# EAGLE design PocketSDR_Discovery (EAGLE 9.6.2)
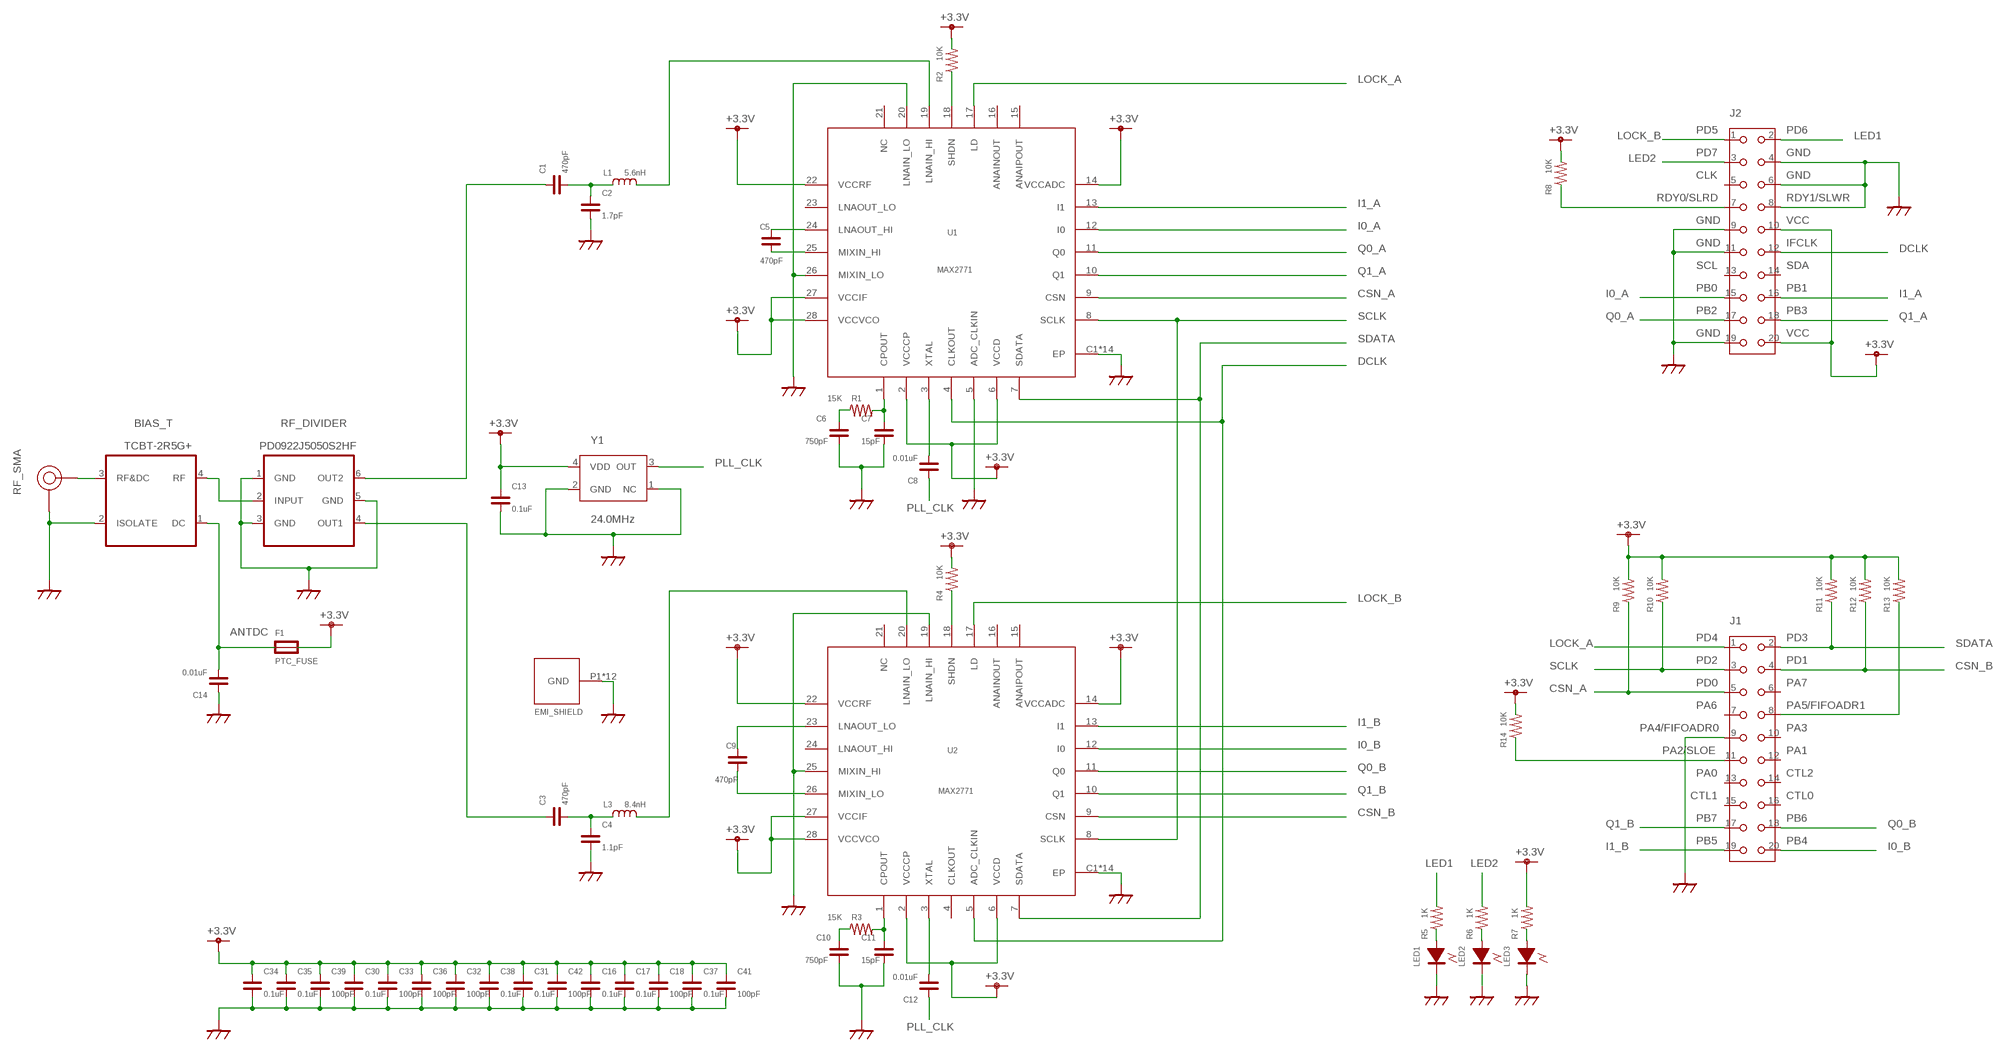
[diagram p0: schematic, sheet 1]

## Parts
BIAS_T  TCBT-2R5G+  BIAS_T  [BIAS_T]
C1  470pF  C1005  [C1005]
C2  1.7pF  C1005  [C1005]
C3  470pF  C1005  [C1005]
C4  1.1pF  C1005  [C1005]
C5  470pF  C1005  [C1005]
C6  750pF  C1005  [C1005]
C7  15pF  C1005  [C1005]
C8  0.01uF  C1005  [C1005]
C9  470pF  C1005  [C1005]
C10  750pF  C1005  [C1005]
C11  15pF  C1005  [C1005]
C12  0.01uF  C1005  [C1005]
C13  0.1uF  C1005  [C1005]
C14  0.01uF  C1005  [C1005]
C16  0.1uF  C1005  [C1005]
C17  0.1uF  C1005  [C1005]
C18  100pF  C1005  [C1005]
C30  0.1uF  C1005  [C1005]
C31  0.1uF  C1005  [C1005]
C32  100pF  C1005  [C1005]
C33  100pF  C1005  [C1005]
C34  0.1uF  C1005  [C1005]
C35  0.1uF  C1005  [C1005]
C36  100pF  C1005  [C1005]
C37  0.1uF  C1005  [C1005]
C38  0.1uF  C1005  [C1005]
C39  100pF  C1005  [C1005]
C41  100pF  C1005  [C1005]
C42  100pF  C1005  [C1005]
F1  PTC_FUSE  [C1608]
J1  PINH-2.54MM-20P  [PINH-2.54MM-20P]
J2  PINH-2.54MM-20P  [PINH-2.54MM-20P]
L1  5.6nH  L1608  [C1608]
L3  8.4nH  L1608  [C1608]
LED1  LED1608  [LED_1608]
LED2  LED1608  [LED_1608]
LED3  LED1608  [LED_1608]
R1  15K  R1005  [C1005]
R2  10K  R1005  [C1005]
R3  15K  R1005  [C1005]
R4  10K  R1005  [C1005]
R5  1K  R1005  [C1005]
R6  1K  R1005  [C1005]
R7  1K  R1005  [C1005]
R8  10K  R1005  [C1005]
R9  10K  R1005  [C1005]
R10  10K  R1005  [C1005]
R11  10K  R1005  [C1005]
R12  10K  R1005  [C1005]
R13  10K  R1005  [C1005]
R14  10K  R1005  [C1005]
RF-SHEILD-CASE  BMI-S-202-F BMI-S-202-C  BMI-S-202  [BMI-S-202]
RF_DIVIDER  PD0922J5050S2HF  RF_DIV  [RF_DIV]
RF_SMA  SMA JACK EDGE MNT  SMA-ANG  [SMA-ANG]
U1  MAX2771  [TQFN28]
U2  MAX2771  [TQFN28]
Y1  24.0MHz  TCXO2520  [TCXO2520]

## Nets
+3.3V: C13.1 C16.1 C17.1 C18.1 C30.1 C31.1 C32.1 C33.1 C34.1 C35.1 C36.1 C37.1 C38.1 C39.1 C41.1 C42.1 F1.2 J2.10 J2.20 R2.2 R4.2 R7.2 R8.2 R9.2 R10.2 R11.2 R12.2 R13.2 R14.2 U1.2(VCCCP) U1.6(VCCD) U1.14(VCCADC) U1.22(VCCRF) U1.27(VCCIF) U1.28(VCCVCO) U2.2(VCCCP) U2.6(VCCD) U2.14(VCCADC) U2.22(VCCRF) U2.27(VCCIF) U2.28(VCCVCO) Y1.4(VDD)
ANTDC: BIAS_T.1(DC) C14.2 F1.1
CSN_A: J1.5 R9.1 U1.9(CSN)
CSN_B: J1.4 R12.1 U2.9(CSN)
DCLK: J2.12 U1.4(CLKOUT) U2.5(ADC_CLKIN)
FIFOADR1: J1.8 R13.1
GND: BIAS_T.2(ISOLATE) C2.1 C4.2 C6.2 C7.2 C10.2 C11.2 C13.2 C14.1 C16.2 C17.2 C18.2 C30.2 C31.2 C32.2 C33.2 C34.2 C35.2 C36.2 C37.2 C38.2 C39.2 C41.2 C42.2 J1.9 J2.4 J2.6 J2.8 J2.9 J2.11 J2.19 LED1.2 LED2.2 LED3.2 RF-SHEILD-CASE.P1(GND) RF-SHEILD-CASE.P2(GND) RF-SHEILD-CASE.P3(GND) RF-SHEILD-CASE.P4(GND) RF-SHEILD-CASE.P5(GND) RF-SHEILD-CASE.P6(GND) RF-SHEILD-CASE.P7(GND) RF-SHEILD-CASE.P8(GND) RF-SHEILD-CASE.P9(GND) RF-SHEILD-CASE.P10(GND) RF-SHEILD-CASE.P11(GND) RF-SHEILD-CASE.P12(GND) RF_DIVIDER.1(GND) RF_DIVIDER.3(GND) RF_DIVIDER.5(GND) RF_SMA.P2(GND) RF_SMA.P3(GND) RF_SMA.P4(GND) RF_SMA.P5(GND) U1.5(ADC_CLKIN) U1.20(LNAIN_LO) U1.26(MIXIN_LO) U1.C1(EP) U1.C2(EP) U1.C3(EP) U1.C4(EP) U1.EP U1.V1(EP) U1.V2(EP) U1.V3(EP) U1.V4(EP) U1.V5(EP) U1.V6(EP) U1.V7(EP) U1.V8(EP) U1.V9(EP) U2.19(LNAIN_HI) U2.25(MIXIN_HI) U2.C1(EP) U2.C2(EP) U2.C3(EP) U2.C4(EP) U2.EP U2.V1(EP) U2.V2(EP) U2.V3(EP) U2.V4(EP) U2.V5(EP) U2.V6(EP) U2.V7(EP) U2.V8(EP) U2.V9(EP) Y1.1(NC) Y1.2(GND)
I0_A: J2.15 U1.12(I0)
I0_B: J1.20 U2.12(I0)
I1_A: J2.16 U1.13(I1)
I1_B: J1.19 U2.13(I1)
LED1: J2.2 R5.2
LED2: J2.3 R6.2
LOCK_A: J1.1 U1.17(LD)
LOCK_B: J2.1 U2.17(LD)
N$1: C5.2 U1.25(MIXIN_HI)
N$2: C5.1 U1.24(LNAOUT_HI)
N$3: BIAS_T.3(RF&DC) RF_SMA.P1(RF)
N$4: BIAS_T.4(RF) RF_DIVIDER.2(INPUT)
N$5: LED3.1(+) R7.1
N$6: LED2.1(+) R6.1
N$7: LED1.1(+) R5.1
N$9: C1.2 C2.2 L1.1
N$10: C8.2 U1.3(XTAL)
N$12: L1.2 U1.19(LNAIN_HI)
N$14: C1.1 RF_DIVIDER.6(OUT2)
N$15: C9.2 U2.26(MIXIN_LO)
N$16: C9.1 U2.23(LNAOUT_LO)
N$18: R2.1 U1.18(SHDN)
N$24: C7.1 R1.2 U1.1(CPOUT)
N$25: C6.1 R1.1
N$27: C11.1 R3.2 U2.1(CPOUT)
N$32: C10.1 R3.1
N$35: C3.1 RF_DIVIDER.4(OUT1)
N$37: C3.2 C4.1 L3.1
N$38: L3.2 U2.20(LNAIN_LO)
N$42: R4.1 U2.18(SHDN)
N$43: C12.2 U2.3(XTAL)
PLL_CLK: C8.1 C12.1 Y1.3(OUT)
Q0_A: J2.17 U1.11(Q0)
Q0_B: J1.18 U2.11(Q0)
Q1_A: J2.18 U1.10(Q1)
Q1_B: J1.17 U2.10(Q1)
SCLK: J1.3 R10.1 U1.8(SCLK) U2.8(SCLK)
SDATA: J1.2 R11.1 U1.7(SDATA) U2.7(SDATA)
SLOE: J1.11 R14.1
SLRD: J2.7 R8.1
Unconnected: J1.6 J1.7 J1.10 J1.12 J1.13 J1.14 J1.15 J1.16 J2.5 J2.13 J2.14 U1.15(ANAIPOUT) U1.16(ANAINOUT) U1.21(NC) U1.23(LNAOUT_LO) U2.4(CLKOUT) U2.15(ANAIPOUT) U2.16(ANAINOUT) U2.21(NC) U2.24(LNAOUT_HI)

## Notes on the sheet
- PD5 | PD6
- PD7 | GND
- CLK | GND
- RDY0/SLRD | RDY1/SLWR
- GND | VCC
- GND | IFCLK
- SCL | SDA
- PB0 | PB1
- PB2 | PB3
- GND | VCC
- PD4 | PD3
- PD2 | PD1
- PD0 | PA7
- PA6 | PA5/FIFOADR1
- PA4/FIFOADR0 | PA3
- PA2/SLOE | PA1
- PA0 | CTL2
- CTL1 | CTL0
- PB7 | PB6
- PB5 | PB4

## Library data of the parts
BIAS_T = ttaka_misc2:BIAS_T
C1-C14 C16-C18 C30-C39 C41 C42 = ttaka_desc:C1005
F1 = ttaka_desc:PTC_FUSE
J1 J2 = ttaka_conn:PINH-2.54MM-20P
L1 L3 = ublox:L1608
LED1-LED3 = ttaka_desc:LED1608
R1-R14 = ttaka_desc:R1005
RF-SHEILD-CASE = ttaka_misc:BMI-S-202
RF_DIVIDER = ttaka_misc:RF_DIV
RF_SMA = ttaka_conn:SMA-ANG
U1 U2 = ttaka_ic:MAX2771
Y1 = ttaka_misc:TCXO2520

## Board
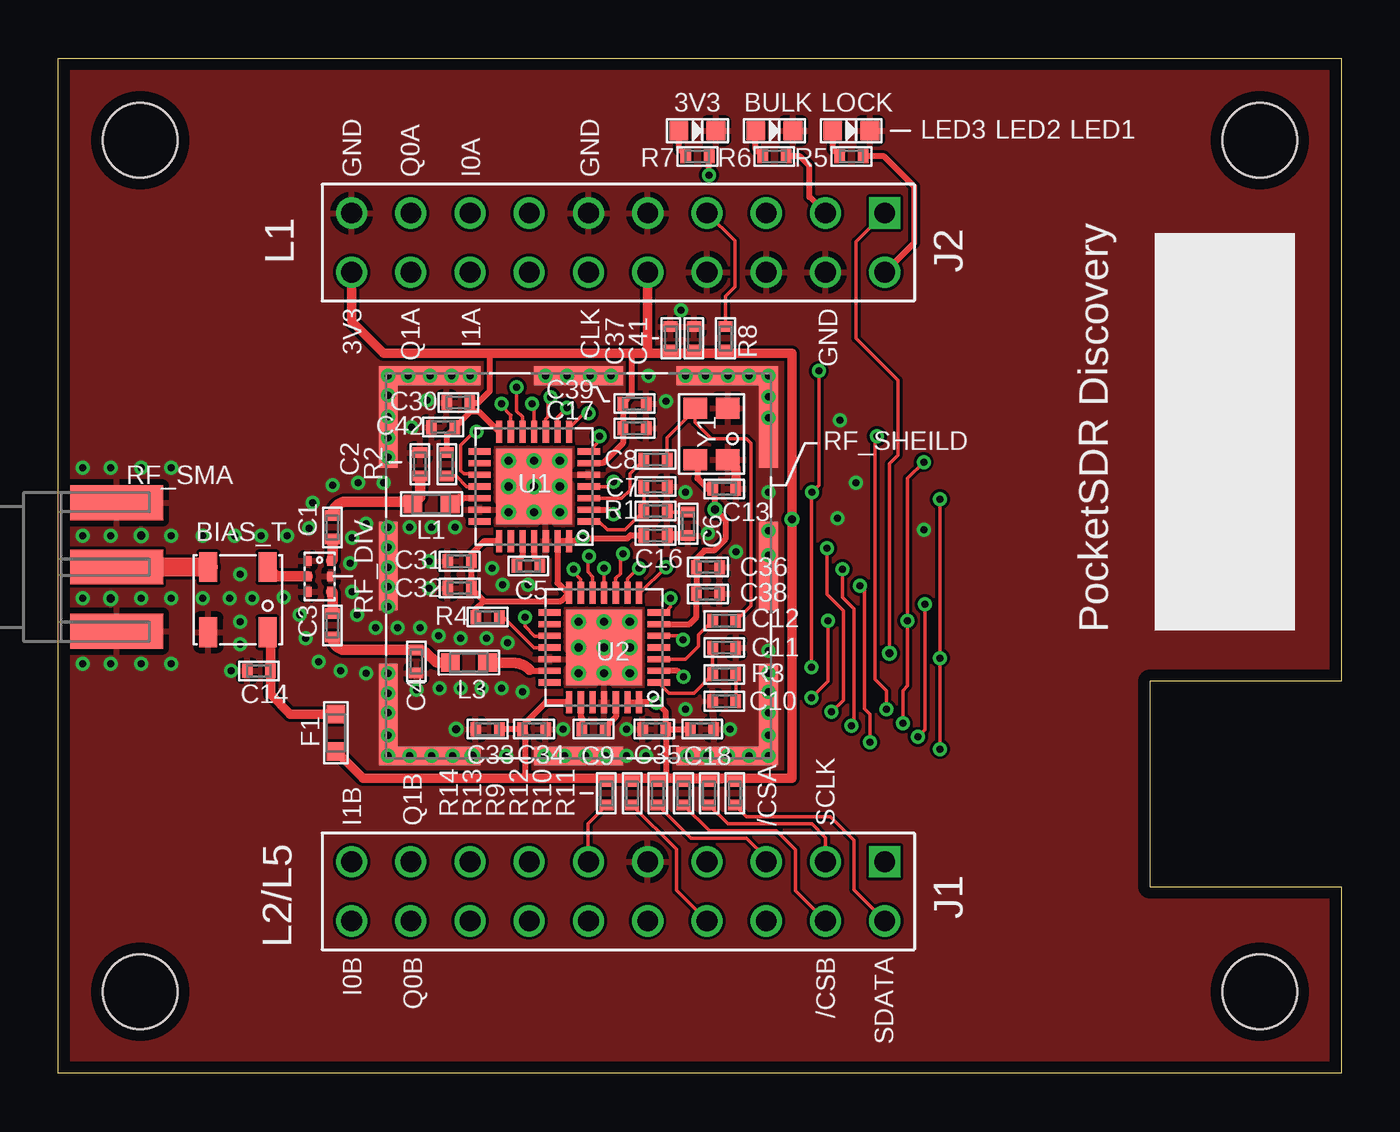
[diagram p1: board, top side]
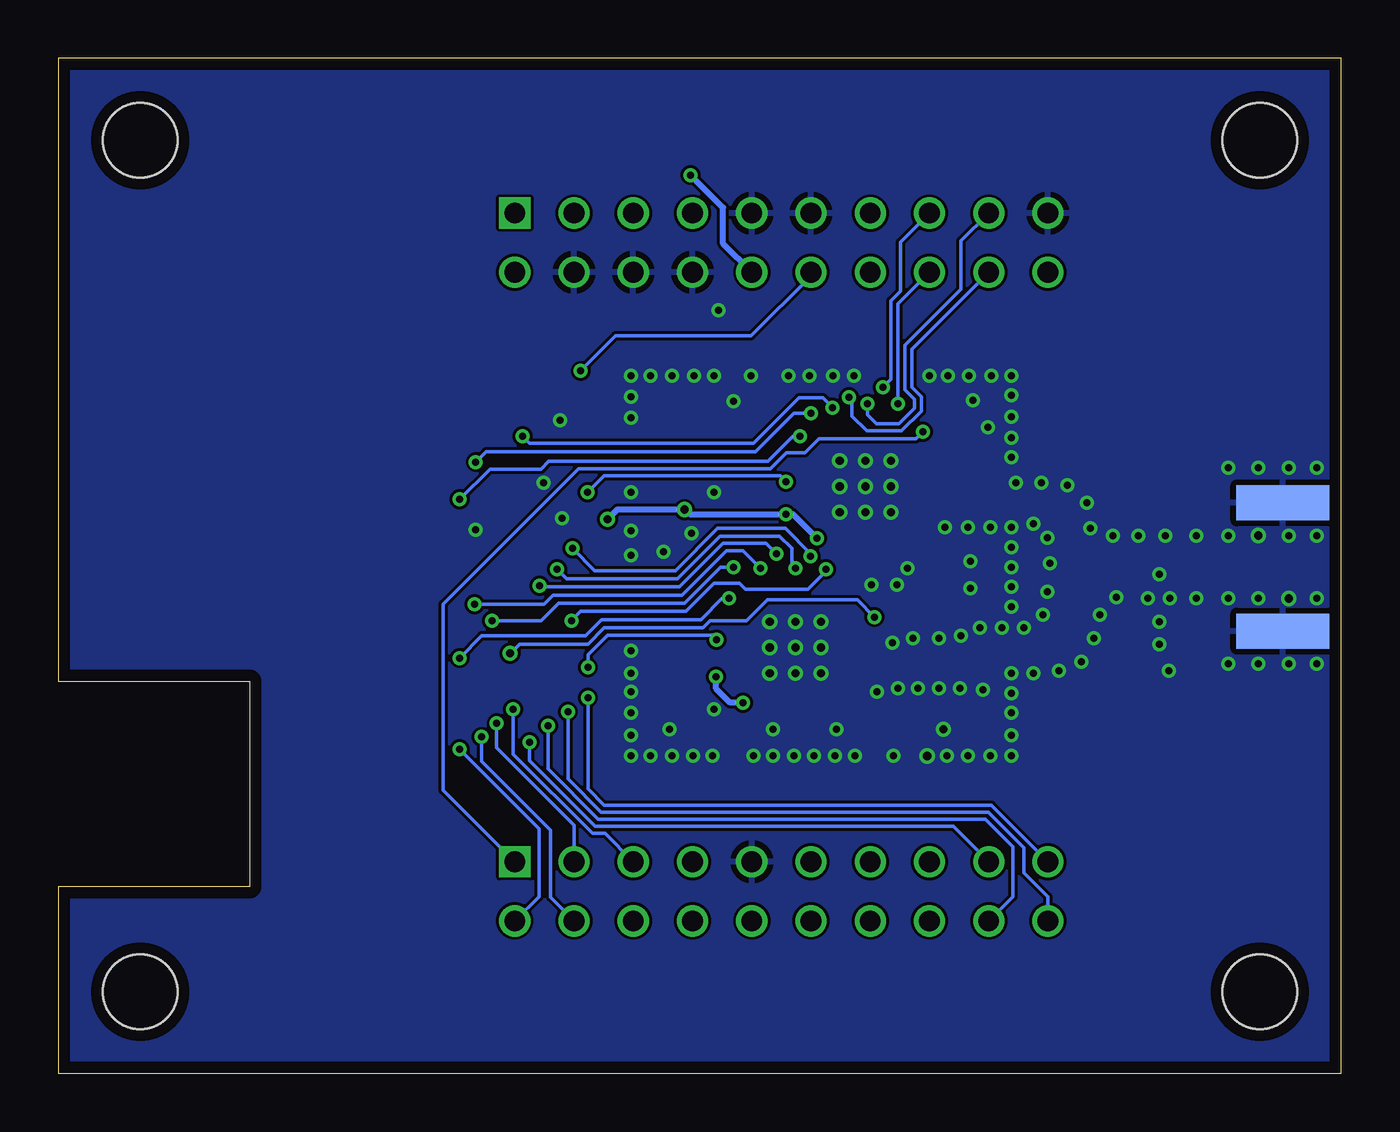
[diagram p2: board, bottom side, seen from below]

Size 55 x 43.5 mm. Coordinates in mm from the lower left corner, seen from the top.
Outline: 0,0 0,43.5 55,43.5 55,16.8 46.8,16.8 46.8,8 55,8 55,0 0,0
Copper layers (1*16): Top 0.035mm / dielectric 1.53mm / Bottom 0.035mm
Design rules "pban_5mil-l2": minimum track width 5mil, minimum drill 0.3mm, track to track 5mil, track to pad 0.229mm, pad to pad 5mil, via to via 5mil, smd to smd 5mil, copper to edge 0.5mm, drill to drill 0.5mm, minimum pad ring 0.15mm, minimum via ring 0.15mm, stop-mask expansion 4mil, vias tented up to drill 0.35mm, thermal gap 10mil
Holes 3.2 mm at 3.5,40 51.5,40 3.5,3.5 51.5,3.5

### Footprints (pad centres in the part's own frame; a part is rotated, then mirrored left to right if it is on the bottom)
BIAS_T = smd 0.762 x 1.27: 1 -1.27,1.397; 2 1.27,1.397; 3 1.27,-1.397; 4 -1.27,-1.397
C1005 = smd 0.45 x 0.6: 1 -0.5,0; 2 0.5,0
C1608 = smd 0.8 x 0.8: 1 -0.8,0; 2 0.8,0
PINH-2.54MM-20P = drill 0.889 square: 1 -11.43,-1.27 | drill 0.889: 2 -11.43,1.27; 3 -8.89,-1.27; 4 -8.89,1.27; 5 -6.35,-1.27; 6 -6.35,1.27; 7 -3.81,-1.27; 8 -3.81,1.27; 9 -1.27,-1.27; 10 -1.27,1.27; 11 1.27,-1.27; 12 1.27,1.27; 13 3.81,-1.27; 14 3.81,1.27; 15 6.35,-1.27; 16 6.35,1.27; 17 8.89,-1.27; 18 8.89,1.27; 19 11.43,-1.27; 20 11.43,1.27
LED_1608 = smd 0.8 x 0.8: 1 -0.8,0; 2 0.8,0
BMI-S-202 = smd 4.35 x 0.8: P1 -6.375,-8.15; P3 6.375,-8.15; P7 6.375,8.15; P9 -6.375,8.15 | smd 3.8 x 0.8: P2 0,-8.15; P8 0,8.15 | smd 0.8 x 4.36: P4 8.15,-6.375; P6 8.15,6.375; P10 -8.15,6.375; P12 -8.15,-6.375 | smd 0.8 x 3.8: P5 8.15,0; P11 -8.15,0
RF_DIV = smd 0.41 x 0.33: 1 0.66,0.5; 2 0,0.5; 3 -0.66,0.5; 4 -0.66,-0.5; 5 0,-0.5; 6 0.66,-0.5
SMA-ANG = smd 1.499 x 3.988: P1 0,-4; P2 -2.75,-4; P3 2.75,-4 | smd 1.499 x 3.988 bottom: P4 -2.75,-4; P5 2.75,-4
TQFN28 = smd 0.26 x 0.95: 1 -1.5,-2.34; 2 -1,-2.34; 3 -0.5,-2.34; 4 0,-2.34; 5 0.5,-2.34; 6 1,-2.34; 7 1.5,-2.34; 15 1.5,2.34; 16 1,2.34; 17 0.5,2.34; 18 0,2.34; 19 -0.5,2.34; 20 -1,2.34; 21 -1.5,2.34 | smd 0.95 x 0.26: 8 2.34,-1.5; 9 2.34,-1; 10 2.34,-0.5; 11 2.34,0; 12 2.34,0.5; 13 2.34,1; 14 2.34,1.5; 22 -2.34,1.5; 23 -2.34,1; 24 -2.34,0.5; 25 -2.34,0; 26 -2.34,-0.5; 27 -2.34,-1; 28 -2.34,-1.5 | smd 1.4 x 1.4: C1 -0.85,-0.85; C2 0.85,-0.85; C3 -0.85,0.85; C4 0.85,0.85 | smd 3.25 x 3.25: EP 0,0 | drill 0.35: V1 -1.1,-1.1; V2 0,-1.1; V3 1.1,-1.1; V4 -1.1,0; V5 0,0; V6 1.1,0; V7 -1.1,1.1; V8 0,1.1; V9 1.1,1.1
TCXO2520 = smd 0.9 x 1: 1 -1.1,-0.7; 2 1.1,-0.7; 3 1.1,0.7; 4 -1.1,0.7

### Placement (x,y rotation side)
BIAS_T  7.7,20.3 180 top
C1  11.75,23.4 90 top
C2  15.5,26.1 270 top
C3  11.75,19.2 270 top
C4  15.35,17.65 270 top
C5  20.15,21.75 0 top
C6  27,23.55 270 top
C7  25.6,25.15 0 top
C8  25.6,26.3 180 top
C9  22.95,14.75 0 top
C10  28.55,15.95 180 top
C11  28.55,18.25 0 top
C12  28.55,19.4 180 top
C13  28.55,25.05 0 top
C14  8.6,17.25 0 top
C16  25.6,23.05 0 top
C17  24.7,27.65 0 top
C18  27.6,14.75 0 top
C30  17.15,28.75 180 top
C31  17.2,21.95 180 top
C32  17.2,20.8 180 top
C33  18.4,14.75 180 top
C34  20.4,14.75 0 top
C35  25.55,14.75 180 top
C36  27.85,21.7 0 top
C37  26.25,31.5 90 top
C38  27.85,20.55 0 top
C39  24.7,28.7 0 top
C41  27.25,31.5 90 top
C42  16.5,27.7 180 top
F1  11.9,14.6 270 top
J1  24,7.8 180 top
J2  24,35.6 180 top
L1  16,24.4 0 top
L3  17.6,17.6 0 top
LED1  34,40.4 0 top
LED2  30.7,40.4 0 top
LED3  27.4,40.4 0 top
R1  25.6,24.1 180 top
R2  16.65,26.1 90 top
R3  28.55,17.1 180 top
R4  18.4,19.55 180 top
R5  34,39.3 0 top
R6  30.7,39.3 0 top
R7  27.4,39.3 0 top
R8  28.6,31.5 270 top
R9  25.7,12 90 top
R10  27.9,12 90 top
R11  29,12 90 top
R12  26.8,12 90 top
R13  24.6,12 90 top
R14  23.5,12 90 top
RF-SHEILD-CASE  22.3,21.75 0 top
RF_DIVIDER  11.2,21.3 90 top
RF_SMA  -1.5,21.7 90 top
U1  20.4,25.15 90 top
U2  23.4,18.25 90 top
Y1  28,27.4 90 top

### Tracks (layer width: path | path; a pad name or v marks a point on that pad's centre or on a via)
+3.3V  (via drill 0.3, 0.35)
  Top 0.152: 17.65,28.7 C30.1 | R12.2 28.46,12.5 28.6,12.64 | C37.1 26.25,30.9 26.3,30.85 | 27.25,30.85 C41.1 27.4,30.85 | R8.2 28.6,30.85
  Top 0.254: U1.22 18.26,22.81 17.7,22.25 C31.1 C32.1 18.26,20.24 | v26.8,16.99 26.54,17.25 U2.2 | U1.2 23.62,24.15 v23.81,23.96 | 24.6,30.85 24.6,29.1 C39.1 C17.1 24.2,27 23.35,26.15 U1.6 | C30.1 18,28.75 18.5,29.25 18.5,30.85 | 18.26,20.24 21.55,20.24 U2.14 21.84,20.59 21.4,21.02 U1.27 U1.28 22.16,22.81 22.27,22.93 v22.47,22.93 24.39,22.93 24.53,23.07 25.08,23.07 C16.1 | C35.1 26.05,15.49 v25.65,15.89 25.63,15.91 U2.28 U2.27 | C34.1 20,14.65 20,12.64 | C34.1 C33.1 | C34.1 19.9,14.9 20.91,15.91 U2.22 | U2.6 27.05,19.25 27.35,19.55 C38.1 C36.1 27.35,22.05 27.7,22.4 28.1,22.4 28.6,22.9 28.6,23.71 v28.15,24.16 28.15,24.95 C13.1 27.85,25.05 27.4,25.5 27.4,26.2 Y1.4 | R2.2 16.65,27.35 C42.1 17.65,28.35 | 17.65,28.35 17.65,28.7 | R4.2 17.9,19.88 18.26,20.24 | C35.1 C18.1 | 23.5,12.64 R14.2 | v27.9,38.5 R7.2 | 17.65,28.35 18.04,28.35 U1.14 | C35.1 26.05,12.69 | R13.2 24.6,12.64 | R9.2 25.7,12.64 | R12.2 26.8,12.64 | R10.2 27.9,12.64 | R11.2 29,12.64
  Top 0.406: 23.5,12.64 20,12.64 13.06,12.64 F1.2 | 26.3,30.85 27.25,30.85 | 27.4,30.85 28.6,30.85 31.45,30.85 v31.45,23.75 31.45,12.64 29,12.64 28.6,12.64 27.9,12.64 26.8,12.64 26,12.64 | C13.1 28.05,25 | J2.20 12.57,32.23 13.95,30.85 18.5,30.85 24.6,30.85 25.3,30.85 | 26.25,30.9 26.2,30.85 25.3,30.85 | J2.10 25.27,30.88 25.3,30.85 | R14.2 23.64,12.64 24.6,12.64 25.7,12.64 26,12.64 | 26.05,12.69 26,12.64
  Bottom 0.254: v22.47,22.93 v22.48,22.93 23.51,23.96 v23.81,23.96 27.95,23.96 v28.15,24.16 31.04,24.16 v31.45,23.75 | v25.65,15.89 26.2,15.89 26.8,16.49 v26.8,16.99 | J2.10 26.5,35.56 26.5,37.1 v27.9,38.5
ANTDC
  Top 0.406: F1.1 9.95,15.4 9.1,16.25 C14.2 9.1,18.59 arc45 BIAS_T.1
CSN_A  (via drill 0.3)
  Top 0.152: v21.8,28.52 21.4,28.12 U1.9 | J1.5 30.35,9.24 29.5,10.09 27.11,10.09 R9.1 | v35.5,15.6 35.5,16.4 35,16.9 35,27.2 v35.1,27.3
  Bottom 0.152: v21.8,28.52 22.23,28.94 23.26,28.94 25.19,27.01 34.81,27.01 v35.1,27.3 | J1.5 31.56,10.28 32.1,10.28 35.5,13.68 v35.5,15.6
CSN_B  (via drill 0.3)
  Top 0.152: U2.9 24.4,21.19 24.41,21.19 24.41,21.21 24.84,21.64 v24.9,21.64 | J1.4 31.6,7.82 31.6,9.59 30.8,10.39 27.91,10.39 R12.1 | v37.16,20.1 37.16,14.71 v36.86,14.41
  Bottom 0.152: v24.9,21.64 25.65,22.39 26.36,22.39 28.26,20.5 33.79,20.5 34.18,20.1 v37.16,20.1 | J1.4 33.9,7.54 33.9,10.41 36.86,13.37 v36.86,14.41
DCLK  (via drill 0.3)
  Top 0.152: v26.78,18.58 26.61,18.75 U2.5 | U1.4 23.6,25.15 v23.8,25.35 | v32.3,17.4 32.3,24.89 v32.31,24.9 32.61,25.2 32.61,30.09 v32.6,30.1
  Bottom 0.152: v23.8,25.35 24.05,25.6 31.61,25.6 v32.31,24.9 | v26.78,18.58 26.98,18.78 31.45,18.78 32.3,17.93 v32.3,17.4 | v32.6,30.1 31.1,31.6 25.3,31.6 22.73,34.17 J2.12
FIFOADR1
  Top 0.152: R13.1 26.5,9.6 26.5,7.84 J1.8
GND  (via drill 0.3, 0.35)
  Top 0.406: C6.2 C16.2 | C13.2 29.05,25.95 Y1.1
  other vias: 3.55,20.35 2.25,23.05 3.55,23.05 4.85,23.05 2.25,20.35 4.85,20.35 16,23.4 15.05,23.4 17,23.4 9.65,20.4 10.35,19.65 10.6,18.65 11.15,17.65 13.6,19.1 13.2,23.55 14.55,19.1 19.9,16.35 16.3,18.75 17.25,18.65 18.35,18.65 19.25,18.45 10.9,24.45 30.45,29.9 30.45,13.6 26.9,29.9 27.75,29.9 29.6,29.9 28.7,29.9 16.85,29.9 15.95,29.9 15,29.9 14.15,29.9 14.15,29.05 14.15,28.15 14.15,27.25 14.15,26.4 14.15,23.4 14.15,22.55 14.15,21.7 14.15,20.85 14.15,17.15 14.15,16.3 14.15,15.45 14.15,14.5 14.15,13.6 15.05,13.6 16,13.6 16.9,13.6 17.75,13.6 20.85,13.6 21.7,13.6 22.6,13.6 23.45,13.6 26.95,13.6 27.8,13.6 28.7,13.6 29.6,13.6 30.45,14.5 30.45,15.45 30.45,16.35 30.45,17.15 12.1,17.25 11.75,25.2 7.55,23.05 8.7,23.05 7.35,20.35 9.8,23.05 1.05,25.95 1.05,17.55 26.7,32.7 17.25,16.5 16.35,16.5 18.15,16.5 19,16.5 15.5,19.1 14.15,20 21.65,14.75 30.45,29 30.45,24.9 30.45,23.25 30.45,22.2 25.3,29.9 29.05,22.35 19.2,13.6 18.6,21.65 17.05,14.75 6.2,23.05 10.75,23.35 8.3,20.35 26.9,15.6 26.9,24.9 25.2,13.6 1.05,23.05 1.05,20.35 7.8,18.4 15.8,28.85 15.15,27.7 15.9,21.95 15.9,20.8 24.35,14.75 28.8,14.75 27.85,23.15 26.05,28.8 30.45,18.1 24.35,13.6 6.2,20.35 15.35,16.45 7.4,17.25 7.8,19.35 7.8,21.4 20.15,20.95 19.05,20.95 23.7,29.9 22.8,29.9 21.8,29.9 20.9,29.9 12.85,25.3 13.95,25.3 12.6,22.95 12.5,21.85 12.6,20.65 12.8,19.65 13.2,17.15 17.65,29.9 33.4,23.8 37.1,23.3 34.2,25.3 33.5,28 2.25,25.95 3.55,25.95 4.85,25.95 2.25,17.55 3.55,17.55 4.85,17.55 30.45,28.1
  pour Top: -0.5,44 -0.5,-0.6 55.5,-0.6 55.5,44
  pour Bottom: -1,44.5 -1,-1.1 56,-1.1 56,44.5
I0_A  (via drill 0.3)
  Top 0.152: v19.66,29.4 19.66,28.38 19.9,28.14 U1.12
  Bottom 0.152: J2.15 18.9,35.62 18.9,33.51 19.3,33.11 19.3,29.75 v19.66,29.4
I0_B  (via drill 0.3)
  Top 0.152: v22.76,22.17 22.7,22.11 22.7,21.49 22.9,21.29 U2.12 | v32.96,22.5 32.96,20.53 33.66,19.83 33.66,16 v33.16,15.5
  Bottom 0.152: v22.76,22.17 22.76,22.27 23.84,23.35 26.75,23.35 28.55,21.55 32.01,21.55 v32.96,22.5 | J1.20 12.57,7.56 13.6,8.59 13.6,9.67 15.13,11.2 31.73,11.2 33.16,12.62 v33.16,15.5
I1_A  (via drill 0.3)
  Top 0.152: v19,28.7 19,28.6 19.4,28.2 U1.13
  Bottom 0.152: v19,28.7 19,32.98 J2.16
I1_B  (via drill 0.3)
  Top 0.152: v22.08,21.6 22.08,21.5 22.4,21.18 U2.13 | v33,19.4 33,16.8 v32.3,16.1
  Bottom 0.152: v22.08,21.6 22.08,21.53 22.87,20.74 25.54,20.74 25.79,20.99 26.89,20.99 28.09,19.8 32.6,19.8 v33,19.4 | J1.19 15,11.5 31.6,11.5 32.3,12.2 v32.3,16.1
LED1
  Top 0.254: J2.2 36.7,35.6 36.7,38 35.4,39.3 R5.2
LED2
  Top 0.254: J2.3 32.2,37.56 32.2,38.9 31.8,39.3 R6.2
LOCK_A  (via drill 0.3)
  Top 0.152: U1.17 18.02,25.69 17.39,25.69 17.26,25.82 17.26,26.92 17.83,27.49 v17.93,27.49
  Bottom 0.152: v17.93,27.49 18.22,27.2 22.4,27.2 23,26.6 23.77,26.6 24.46,25.91 32.69,25.91 38.5,20.1 38.5,12.14 J1.1
LOCK_B  (via drill 0.3, 0.35)
  Top 0.152: U2.17 20.42,18.74 20,19.16 v20,19.56 | v35.63,18 35.63,26.13 36,26.5 36,29.7 34.2,31.5 34.2,35.64 J2.1
  Bottom 0.152: v20.01,19.56 v20,19.56 20.75,20.3 24.6,20.3 25.5,19.39 27.07,19.39 27.36,19.1 31.6,19.1 32.3,18.4 35.23,18.4 v35.63,18
N$1
  Top 0.254: U1.25 20.4,22.16 20.65,21.91 C5.2
N$2
  Top 0.152: U1.24
  Top 0.254: U1.24 19.91,22.19 19.65,21.93 C5.1
N$3
  Top 0.508: 3.5,21.7 RF_SMA.P1
  Top 0.813: BIAS_T.3 3.5,21.7
N$4
  Top 0.45: RF_DIVIDER.2 9.37,21.3 BIAS_T.4
N$5
  Top 0.254: R7.1 26.6,39.6 LED3.1
N$6
  Top 0.254: R6.1 29.9,39.6 LED2.1
N$7
  Top 0.254: R5.1 33.2,39.6 LED1.1
N$9
  Top 0.254: 15.3,24.5 L1.1
  Top 0.45: C1.2 arc-90 12.35,24.5 14.96,24.5 arc-45 L1.1 | C2.2 15.5,24.7 15.3,24.5
N$10
  Top 0.152: U1.3 24.15,24.65 24.5,25 24.5,25.7 C8.2
N$12
  Top 0.152: L1.2 16.86,24.46
  Top 0.254: U1.19 17.15,24.65 17.2,24.6
  Top 0.45: 16.86,24.46 arc45 17.2,24.6
N$14
  Top 0.45: RF_DIVIDER.6 arc90 11.75,22.01 C1.1
N$15
  Top 0.254: U2.26 23.91,15.29 23.45,14.83 C9.2
N$16
  Top 0.254: U2.23 22.4,15.3 22.45,15.25 C9.1
N$18
  Top 0.152: R2.1 17.05,25.6 17.5,25.15 U1.18
N$24
  Top 0.152: U1.1 23.19,23.65 23.54,23.3 24.3,23.3 R1.2 C7.1
N$25
  Top 0.152: C6.1 26.15,24.05 R1.1
N$27
  Top 0.152: C11.1 R3.2 27.25,16.3 26.19,16.3 U2.1
N$32
  Top 0.152: R3.1 C10.1
N$35
  Top 0.45: RF_DIVIDER.4 arc-90 11.75,20.59 C3.1
N$37
  Top 0.45: C3.2 arc90 12.3,18.15 C4.1 arc-45 15.86,17.94 16.1,17.7 arc45 16.34,17.6 16.65,17.6
  Top 0.508: 16.65,17.6 L3.1
N$38
  Top 0.254: 20.2,17.3 arc45 20.32,17.25 U2.20
  Top 0.45: L3.2 19.48,17.6 arc-45 20.2,17.3
N$42
  Top 0.152: U2.18 20.39,18.25 19.09,19.55 R4.1
N$43
  Top 0.152: U2.3 26.9,17.75 27.45,18.3 27.45,18.8 C12.2
PLL_CLK
  Top 0.152: C12.1 29.7,20.05 29.7,27 29.5,27.2 28,27.2 27.3,27.9 Y1.3 27.3,28.45 26.1,27.25 C8.1
Q0_A  (via drill 0.3)
  Top 0.152: U1.11 20.4,28.61 v20.31,28.7
  Bottom 0.152: v20.31,28.7 20.31,28.23 19.93,27.84 18.97,27.84 18.3,28.51 18.3,28.9 18.7,29.3 18.7,31.2 16.3,33.6 16.3,35.68 J2.17
Q0_B  (via drill 0.3)
  Top 0.152: U2.11 23.4,21.1 23.41,21.11 v23.41,21.65 | v33.61,21.6 33.61,20.41 34.11,19.91 34.11,15 v34.01,14.9
  Bottom 0.152: v23.41,21.65 23.56,21.8 23.56,22.5 24.08,23.02 26.63,23.02 28.45,21.2 33.21,21.2 v33.61,21.6 | J1.18 14.08,7.56 14.08,9.72 15.25,10.89 31.85,10.89 34.01,13.05 v34.01,14.9
Q1_A  (via drill 0.3)
  Top 0.152: v21.11,28.97 21,28.86 21,28.14 20.9,28.04 U1.10
  Bottom 0.152: v21.1,28.96 v21.11,28.97 20.97,28.83 20.97,28.17 20.34,27.54 18.84,27.54 18,28.38 18,29 18.4,29.4 18.4,31.04 J2.18
Q1_B  (via drill 0.3)
  Top 0.152: U2.10 23.9,21.22 24.1,21.42 24.1,22.15 v24.22,22.27 | v34.37,20.9 34.57,20.7 34.57,15.63 34.8,15.4 v34.8,14.2
  Bottom 0.152: v24.22,22.27 24.67,22.72 26.5,22.72 28.36,20.86 34.32,20.86 v34.37,20.9 | J1.17 16.63,10.59 31.98,10.59 34.8,13.41 v34.8,14.2
SCLK  (via drill 0.3)
  Top 0.152: U1.8 21.9,27.64 22.55,28.29 v22.73,28.29 | U2.8 24.95,20.59 v26.05,21.7 | J1.3 32.9,10.1 32.3,10.7 28.7,10.7 R10.1 | v37.1,26.2 36.4,25.5 v36.4,19.4 36.4,16.6 36.2,16.4 v36.2,15
  Bottom 0.152: v22.73,28.29 23.46,28.29 25.11,26.64 36.66,26.64 v37.1,26.2 | v26.05,21.7 26.6,21.7 28.15,20.15 33.55,20.15 34.3,19.4 v36.4,19.4 | J1.3 32.89,10.63 36.2,13.95 v36.2,15
SDATA  (via drill 0.3)
  Top 0.152: U1.7 22.76,26.65 23.21,27.1 v23.21,27.3 | U2.7 26,19.75 26.25,20 v26.25,20.35 | J1.2 34.1,7.86 34.1,10 33.1,11 29.5,11 R11.1 | v37.8,24.6 v37.8,17.8 v37.8,13.9
  Bottom 0.152: v23.21,27.3 23.51,27.3 24.58,26.23 33.97,26.23 34.3,25.9 36.5,25.9 v37.8,24.6 | v26.25,20.35 26.55,20.35 27.45,19.45 31.7,19.45 32.4,18.75 36.85,18.75 v37.8,17.8 | J1.2 34.4,7.56 34.4,10.48 37.8,13.88 v37.8,13.9
SLOE
  Top 0.152: J1.11 22.73,9.13 22.7,9.16 22.7,10.7 R14.1
SLRD
  Top 0.152: R8.1 28.6,33.3 29,33.7 29,35.68 J2.7

### Text on the board
tPlace: 3V3 | BULK | LOCK | GND | Q0A | I0A | GND | L1 | 3V3 | Q1A | I1A | CLK | GND | PocketSDR Discovery | I1B | Q1B | /CSA | SCLK | L2/L5 | I0B | Q0B | /CSB | SDATA
tNames: RF_SHEILD | BIAS_T | RF_DIV